# Altium project dalibors-dock.PrjPcb
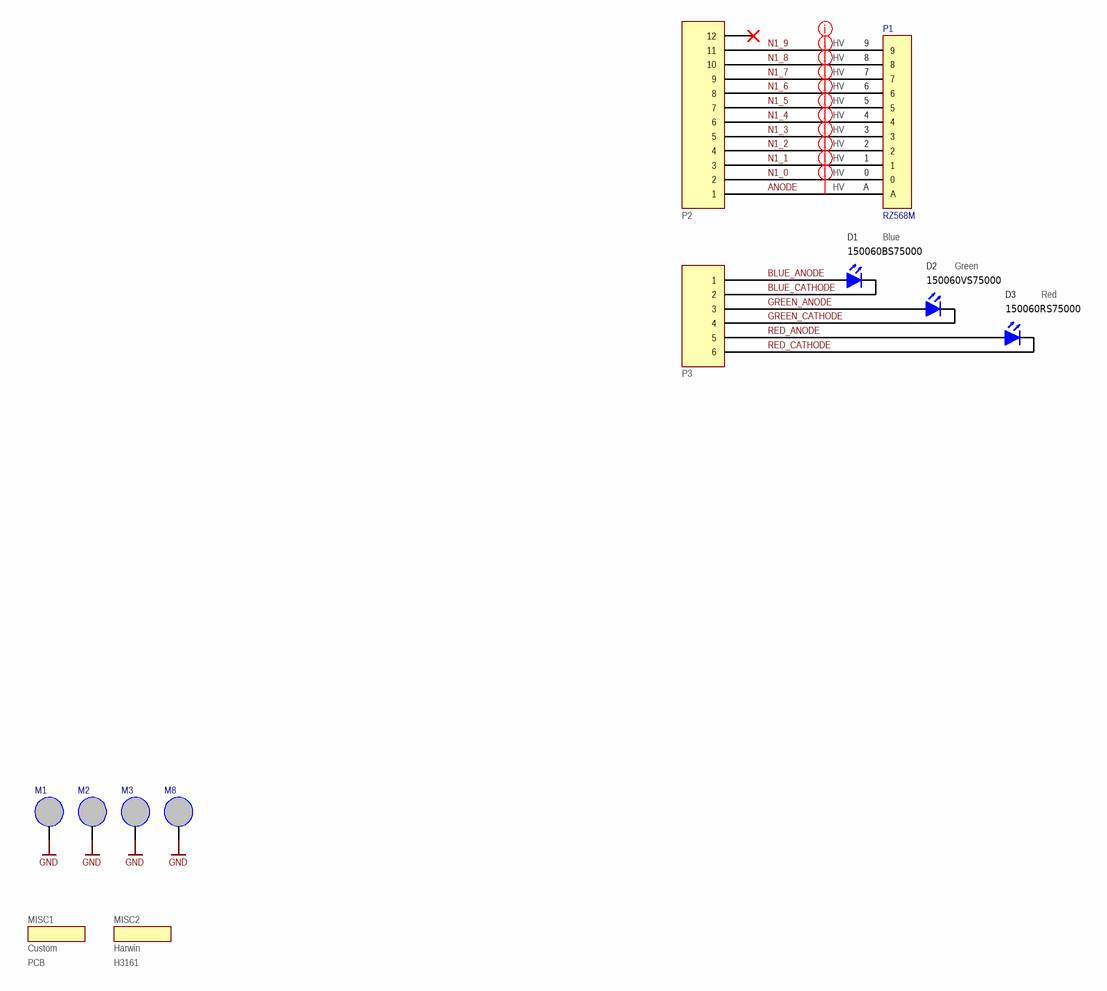
[diagram p0: dalibors-dock.SchDoc]
Revision: 2.0; Release: 1; QualityByDate: N/A; QualityBy: N/A; ManagerDate: N/A; Manager: N/A; EngineerDate: 11/6/2019; Engineer: J. Brinton; DrawnByDate: 11/6/2019; DrawnBy: J. Brinton; CompanyEmail: maybe.i.reply@amaya.tech; CompanyAddress: Lafayette, California; Company: Amaya Tech, Inc.; ClientProject: Dalibors Dock; ClientAddress: Lafayette, California; Client: Amaya Tech, Inc.; CheckedByDate: N/A; CheckedBy: N/A
1 sheet, 12 parts. Net scope: global (net labels, ports and power ports of the same name join across sheets).
Board file: dalibors-dock.PcbDoc

## Sheet dalibors-dock.SchDoc: Main
size Letter; DrawnBy: J. Brinton; Engineer: J. Brinton; Revision: 1; SheetNumber: 1; SheetTotal: 1

### Parts
D1  150060BS75000‎  Note: Blue  [0603_LED]
D2  150060VS75000‎  Note: Green  [0603_LED]
D3  150060RS75000‎  Note: Red  [0603_LED]
M1  MOUNT  [MOUNT1-4_20]  (value not drawn)  (no BOM)
M2  MOUNT  [MOUNT1-4_20]  (value not drawn)  (no BOM)
M3  MOUNT  [MOUNT1-4_20]  (value not drawn)  (no BOM)
M8  MOUNT  [MOUNT1-4_20]  (value not drawn)  (no BOM)
MISC1  PCB  Manufacturer: Custom  (mechanical)
MISC2  H3161  Manufacturer: Harwin  (mechanical)
P1  RZ568M  [RZ568M]
P2  S12B-XH-A  [S12B-XH-A]  (value not drawn)
P3  S6B-ZR  [S6B-ZR]  (value not drawn)

### Nets
GND: M1.1(MNT) M2.1(MNT) M3.1(MNT) M8.1(MNT)
ANODE: P1.A P2.1
BLUE_ANODE: D1.1(A) P3.1
BLUE_CATHODE: D1.2(K) P3.2
GREEN_ANODE: D2.1(A) P3.3
GREEN_CATHODE: D2.2(K) P3.4
N1_0: P1.0 P2.2
N1_1: P1.1 P2.3
N1_2: P1.2 P2.4
N1_3: P1.3 P2.5
N1_4: P1.4 P2.6
N1_5: P1.5 P2.7
N1_6: P1.6 P2.8
N1_7: P1.7 P2.9
N1_8: P1.8 P2.10
N1_9: P1.9 P2.11
RED_ANODE: D3.1(A) P3.5
RED_CATHODE: D3.2(K) P3.6

Not connected (* = marked no-connect by the designer): P2 12*

### Layout directives
net class HV: ANODE, N1_0, N1_1, N1_2, N1_3, N1_4, N1_5, N1_6, N1_7, N1_8, N1_9

### Notes on the sheet
- Designed By:
- Title
- Engineer
- Revision
- Drawn By
- Date
- Sheet
- of

### Library data of the parts
D1 = LED0603GR: LED, SMT 0603, Color Blue; Manufacturer: Wurth Electronics; Tr: -30:85; Alternate: any same color LED; Manufacturer P/N: 150060BS75000‎; Package: 0603 Polarized
D2 = LED0603GR: LED, SMT 0603, Color Green; Manufacturer: Wurth Electronics; Tr: -30:85; Alternate: any same color LED; Manufacturer P/N: 150060VS75000‎; Package: 0603 Polarized
D3 = LED0603Y: LED, SMT 0603, Color Red; Manufacturer: Wurth Electronics; Tr: -30:85; Alternate: any same color LED; Manufacturer P/N: 150060RS75000‎; Package: 0603 Polarized
MISC1 = M50-1900005: Do Not Place: PURCHASE BUT DNP; Manufacturer P/N: Custom
MISC2 = M50-1900005: Pin Receptacle; Do Not Place: PURCHASE QTY. 66 AND HAND SOLDER; Manufacturer P/N: H3161
P1 = RZ568M: Nixie Tube Socket; Manufacturer: Glow Tube Research; Manufacturer P/N: RZ568M
P2 = S12B-XH-A: 2.5mm pitch right angle 12-position; Manufacturer: JST; Manufacturer P/N: S12B-XH-A
P3 = S6B-ZR: 1.5mm pitch right angle 6-position; Manufacturer: JST; Manufacturer P/N: S6B-ZR
M1-M3 M8 = MOUNT: Manufacturer: *; Manufacturer P/N: *